# EAGLE design OSSC_HDMI_Audio_v1.5_A3b (EAGLE 6.6.0)
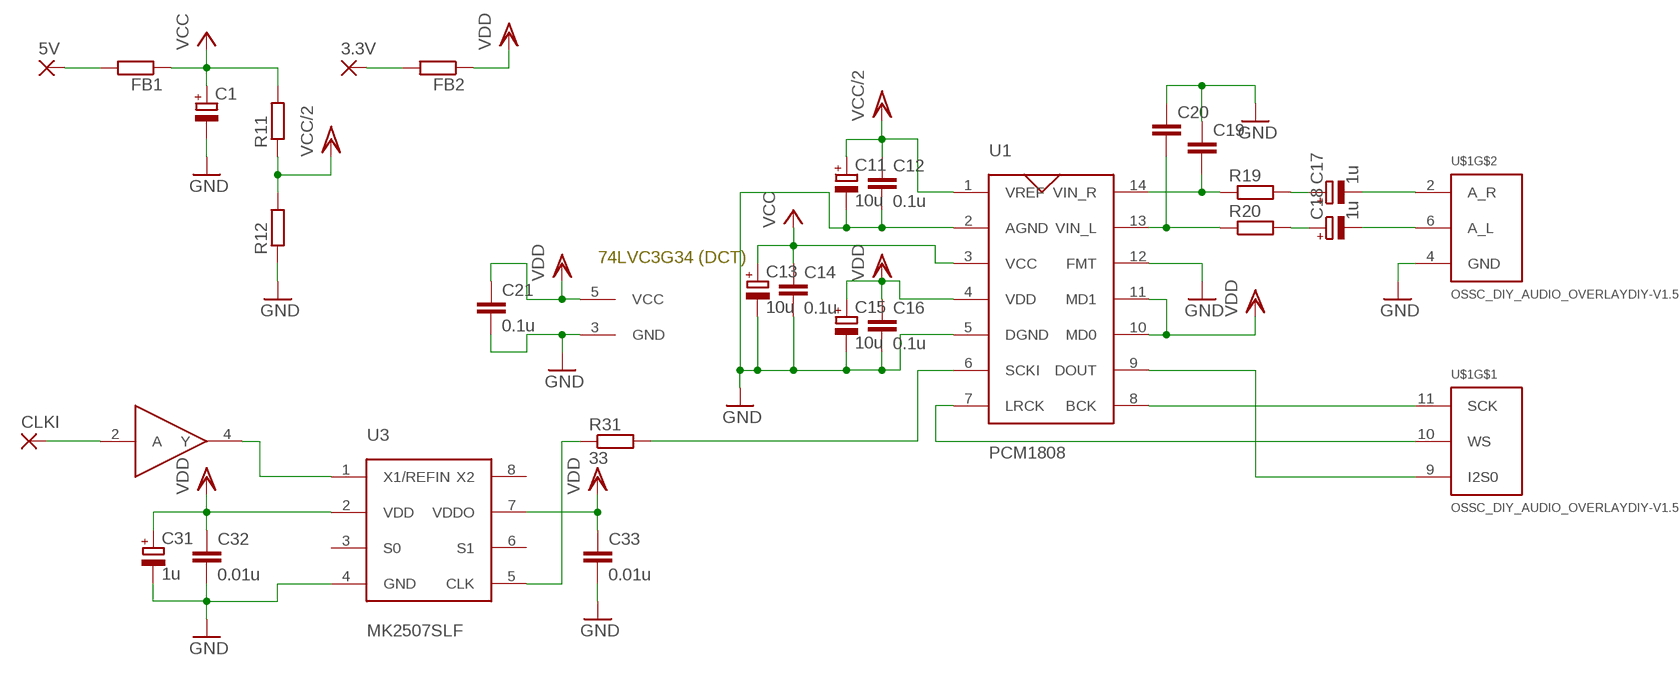
[diagram p0: schematic, sheet 1]

## Parts
3.3V  SMD2  [SMD1,27-2,54]
5V  SMD2  [SMD1,27-2,54]
C1  CPOL-EUSMCC  [SMC_C]
C11  10u  CPOL-EUSMCA  [SMC_A]
C12  0.1u  C-EUC0603  [C0603]
C13  10u  CPOL-EUSMCA  [SMC_A]
C14  0.1u  C-EUC0603  [C0603]
C15  10u  CPOL-EUSMCA  [SMC_A]
C16  0.1u  C-EUC0603  [C0603]
C17  1u  CPOL-EUSMCA  [SMC_A]
C18  1u  CPOL-EUSMCA  [SMC_A]
C19  C-EUC0603  [C0603]
C20  C-EUC0603  [C0603]
C21  0.1u  C-EUC0603  [C0603]
C31  1u  CPOL-EUSMCA  [SMC_A]
C32  0.01u  C-EUC0603  [C0603]
C33  0.01u  C-EUC0603  [C0603]
CLKI  SMD2  [SMD1,27-2,54]
FB1  R-EU_R0603  [R0603]
FB2  R-EU_R0603  [R0603]
R11  R-EU_R0603  [R0603]
R12  R-EU_R0603  [R0603]
R19  R-EU_R0603  [R0603]
R20  R-EU_R0603  [R0603]
R31  33  R-EU_R0603  [R0603]
U1  PCM1808  [PCM1808]
U2  74LVC1G34  [74LVC1G34DCK]
U3  MK2507SLF  [SOIC8]
U$1  OSSC_DIY_AUDIO_OVERLAYDIY-V1.5  [OSSC_OVERLAY_V1.5]

## Nets
GND: C1.- C11.- C12.2 C13.- C14.2 C15.- C16.2 C19.1 C20.1 C21.2 C31.- C32.2 C33.2 R12.1 U1.2(AGND) U1.5(DGND) U1.12(FMT) U2.3(GND) U3.4(GND) U$1.4(GND)
N$1: C18.- U$1.6(A_L)
N$2: C17.- U$1.2(A_R)
N$3: C17.+ R19.2
N$4: C19.2 R19.1 U1.14(VIN_R)
N$5: C20.2 R20.1 U1.13(VIN_L)
N$6: C18.+ R20.2
N$7: R31.1 U3.5(CLK)
N$8: U2.4(Y) U3.1(X1/REFIN)
N$9: CLKI.1(P) U2.2(A)
N$10: 5V.1(P) FB1.2
N$11: 3.3V.1(P) FB2.2
N$13: U1.7(LRCK) U$1.10(WS)
N$14: U1.8(BCK) U$1.11(SCK)
N$15: U1.9(DOUT) U$1.9(I2S0)
N$17: R31.2 U1.6(SCKI)
VCC: C1.+ C13.+ C14.1 FB1.1 R11.2 U1.3(VCC)
VCC/2: C11.+ C12.1 R11.1 R12.2 U1.1(VREF)
VDD: C15.+ C16.1 C21.1 C31.+ C32.1 C33.1 FB2.1 U1.4(VDD) U1.10(MD0) U1.11(MD1) U2.5(VCC) U3.2(VDD) U3.7(VDDO)
Unconnected: U3.3(S0) U3.6(S1) U3.8(X2)

## Notes on the sheet
- 74LVC3G34 (DCT)

## Library data of the parts
3.3V 5V CLKI = wirepad:SMD2: SMD PAD
C1 C11 C13 C15 C17 C18 C31 = rcl:CPOL-EU: POLARIZED CAPACITOR, European symbol
C12 C14 C16 C19-C21 C32 C33 = rcl:C-EU: CAPACITOR, European symbol
FB1 FB2 R11 R12 R19 R20 R31 = rcl:R-EU_: RESISTOR, European symbol
U1 = OSSC_HDMI_Audio:PCM1808
U2 = OSSC_HDMI_Audio:74LVC1G34
U3 = OSSC_HDMI_Audio:MK2507SLF
U$1 = OSSC_HDMI_Audio:OSSC_DIY_AUDIO_OVERLAY

## Board
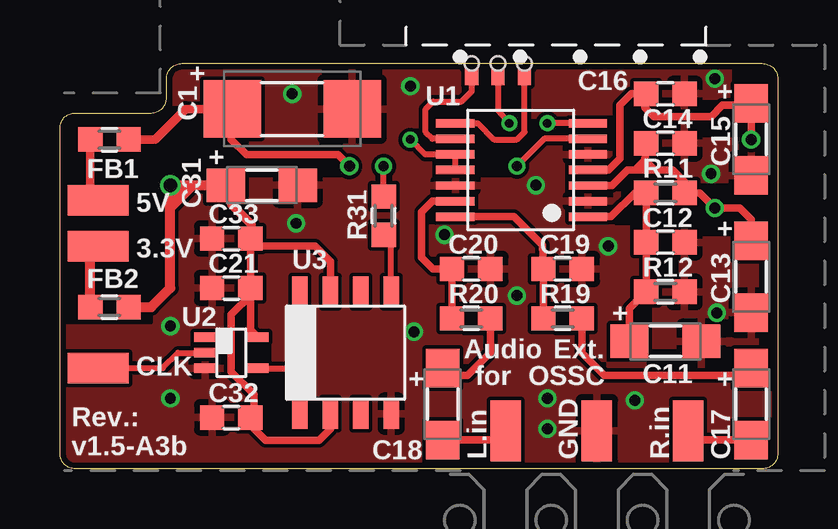
[diagram p1: board, top side]
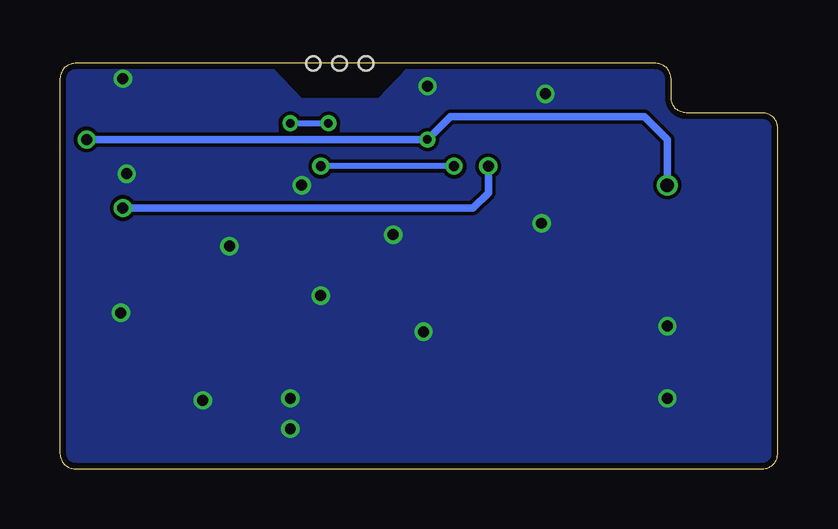
[diagram p2: board, bottom side, seen from below]

Size 29.92 x 16.91 mm. Coordinates in mm from the lower left corner, seen from the top.
Outline: 5.08,16.91 29.29,16.91 arc-90 29.92,16.27 29.92,0.63 arc-90 29.29,0 0.64,0 arc-90 0,0.63 0,14.21 arc-90 0.64,14.84 3.81,14.84 arc90 4.45,15.48 4.45,16.27 arc-90 5.08,16.91
Copper layers (1*16): Top 0.035mm / dielectric 1.5mm / Bottom 0.035mm
Design rules "SeeedStudio_2layer_DRU_no_angle_20140221": minimum track width 6mil, minimum drill 12mil, track to track 6mil, track to pad 6mil, pad to pad 6mil, via to via 6mil, smd to smd 0mil, copper to edge 10mil, drill to drill 10mil, minimum pad ring 10mil, minimum via ring 6mil, stop-mask expansion 2mil, vias tented up to drill 100mil, thermal gap 10mil
tRestrict: area 16.8,5.6 to 17.5,6.9; area 20.6,5.6 to 21.3,6.9; area 23.2,10.2 to 24.3,10.9; area 24.8,7.9 to 26.5,10.9; area 1.7,13.1 to 2.4,14.2; area 10.3,1.7 to 11,2.9; area 6.7,8.2 to 7.8,9; area 6.7,10.2 to 7.1,11; area 29.2,5.1 to 29.8,17.2; area 26.5,10.6 to 29.8,11.8; area 26.5,9.8 to 28.2,10.6; area 17.1,12.2 to 19.1,13.7; 7 more areas

### Footprints (pad centres in the part's own frame; a part is rotated, then mirrored left to right if it is on the bottom)
SMD1,27-2,54 = smd 1.27 x 2.54: 1 0,0
SMC_C = smd 2.4 x 2.4: + -2.5,0; - 2.5,0
SMC_A = smd 1.6 x 1.4: + -1.5,0; - 1.5,0
C0603 = smd 1.016 x 1.016: 1 -0.799,0; 2 0.799,0
R0603 = smd 1.016 x 1.016: 1 -0.799,0; 2 0.799,0
PCM1808 = smd 1.6 x 0.35: 1 -2.8,1.95; 2 -2.8,1.3; 3 -2.8,0.65; 4 -2.8,0; 5 -2.8,-0.65; 6 -2.8,-1.3; 7 -2.8,-1.95; 8 2.725,-1.95; 9 2.725,-1.3; 10 2.725,-0.65; 11 2.725,0; 12 2.725,0.65; 13 2.725,1.3; 14 2.725,1.95
74LVC1G34DCK = smd 0.9 x 0.4: 1 -1.1,0.65; 2 -1.1,0; 3 -1.1,-0.65; 4 1.1,-0.65; 5 1.1,0.65
SOIC8 = smd 1.27 x 0.635: 1 -2.54,1.905; 2 -2.54,0.635; 3 -2.54,-0.635; 4 -2.54,-1.905; 5 2.54,-1.905; 6 2.54,-0.635; 7 2.54,0.635; 8 2.54,1.905
OSSC_OVERLAY_V1.5 = smd 1.27 x 2.54: 2 3.81,8.811; 4 0,8.811; 6 -3.81,8.811 | smd 0.55 x 1.05: 9 -5.221,23.75; 10 -4.121,23.75; 11 -3.021,23.75 | hole 0.6: -3.021,24.13; -4.121,24.13; -5.221,24.13

### Placement (x,y rotation side)
3.3V  1.59,9.29 270 top
5V  1.59,11.19 270 top
C1  9.68,15 0 top
C11  25.24,5.32 0 top
C12  25.24,9.45 0 top
C13  28.81,8.02 270 top
C14  25.24,13.57 0 top
C15  28.81,13.73 270 top
C16  25.24,15.64 0 top
C17  28.81,2.7 270 top
C18  15.95,2.7 270 top
C19  20.95,8.33 180 top
C20  17.14,8.33 180 top
C21  7.14,7.54 180 top
C31  8.41,11.83 0 top
C32  7.14,9.6 180 top
C33  7.14,2.14 180 top
CLKI  1.59,4.21 270 top
FB1  2.06,13.73 180 top
FB2  2.06,6.75 180 top
R11  25.24,11.51 0 top
R12  25.24,7.38 180 top
R19  20.95,6.27 0 top
R20  17.14,6.27 0 top
R31  13.49,10.56 90 top
U1  19.21,12.46 180 top
U2  7.14,4.84 0 top
U3  11.91,4.84 90 top
U$1  22.38,-7.22 0 top

### Tracks (layer width: path | path; a pad name or v marks a point on that pad's centre or on a via)
GND  (via drill 0.46)
  other vias: 20.32,2.94 20.32,1.67 16.03,9.76 22.86,9.29 4.6,5.95 4.6,2.94 9.84,10.24 19.84,11.83 14.76,5.71 14.61,15.95 19.05,7.22 27.15,12.3 23.97,2.86 27.38,6.51 27.3,16.27 9.68,15.64
  pour Top (rank 6): -2.54,-2.14 31.75,-2.14 31.75,17.07 -2.54,17.07
  pour Bottom (rank 6): -1.27,-0.71 30.48,-0.71 30.48,17.07 21.59,17.07 19.92,15.32 16.59,15.32 14.92,17.07 -1.27,17.07
N$1
  Top 0.305: C18.- 18.11,1.2 U$1.6
N$2
  Top 0.305: C17.- 26.66,1.2 U$1.2
N$3
  Top 0.305: R19.2 21.75,4.84 22.7,3.89 28.5,3.89 C17.+
N$4
  Top 0.305: R19.1 C19.2 20.11,9.34 18.94,10.51 U1.14
N$5
  Top 0.305: U1.13 15.53,11.16 15.08,10.72 15.08,8.81 15.56,8.33 C20.2 R20.1
N$6
  Top 0.305: 15.96,4.21 C18.+ 16.26,3.89 16.99,3.89 17.94,4.85 R20.2
N$7
  Top 0.254: U3.5 13.81,9.44 R31.1
N$8
  Top 0.254: U2.4 9.54,4.19 10,3.73 U3.1
N$9
  Top 0.254: CLKI.1 4.29,4.21 4.92,4.84 U2.2
N$10
  Top 0.356: FB1.2 1.27,11.19 5V.1
N$11
  Top 0.406: FB2.2 1.27,9.13 1.59,9.13 3.3V.1
N$13  (via drill 0.36)
  Top 0.254: U1.7 v20.32,14.41 | U$1.10 18.26,14.96 v18.73,14.41
  Bottom 0.254: v20.32,14.41 v18.73,14.41
N$14
  Top 0.254: U1.8 17.42,14.41 18.1,13.73 19.05,13.73 19.37,14.05 19.37,16.44 U$1.11
N$15
  Top 0.254: U1.9 15.53,13.76 15.24,14.05 15.24,15 15.56,15.32 16.75,15.32 17.16,15.73 U$1.9
N$17  (via drill 0.41)
  Top 0.254: R31.2 v13.49,12.62 | U1.6 20.19,13.76 v19.05,12.62
  Bottom 0.254: v13.49,12.62 v19.05,12.62
VCC  (via drill 0.46)
  Top 0.305: 24.39,12.88 23.97,12.46 | 24.39,12.88 24.81,12.46 | 24.61,12.46 23.97,12.46 | 24.81,12.46 24.61,12.46 | 24.61,12.46 24.45,12.62 | 24.81,12.46 25.56,12.46 26.04,11.99 26.04,11.61 R11.2 | 24.39,12.88 C14.1 | v12.06,12.62 11.59,13.1 7.78,13.1 7.14,13.73 7.14,14.96 C1.+ | R11.2 26.09,11.45 | R11.2 26.67,11.51 v27.3,10.87 28.34,10.87 28.81,10.4 C13.+ | U1.3 23,11.81 23.65,12.46 23.97,12.46
  Top 0.356: FB1.1 3.97,13.73 5.24,15 C1.+
  Bottom 0.305: v12.06,12.62 12.06,11.51 12.7,10.87 v27.3,10.87
VCC/2
  Top 0.305: U1.1 22.97,10.51 23.97,11.51 R11.1 C12.1 R12.2 23.74,6.68 C11.+
VDD  (via drill 0.36, 0.46, 0.56)
  Top 0.254: 28.5,15.16 C15.+ | U1.11 U1.10 15.22,13.11 v14.61,13.73
  Top 0.305: 8.1,2.3 8.1,1.67 8.57,1.19 10.79,1.19 11.27,1.67 U3.2 | 28.5,15.16 27.62,15.16 27.15,14.68 24.77,14.68 24.39,15.06 C16.1 23.81,15.64 23.34,15.16 23.34,12.94 22.86,12.46 U1.4 | U3.7 11.27,8.65 10.64,9.29 8.31,9.29 C32.1 C21.1 | C33.1 8.1,2.3 | 8.1,2.3 8.1,3.1 7.14,4.05 7.14,6.43 7.99,7.28 C21.1 | C15.+ v28.81,13.73 | U2.5 7.94,5.79 C21.1
  Top 0.356: C32.1 7.99,10.18 7.14,11.03 7.14,11.6 C31.+
  Top 0.406: FB2.1 3.81,6.75 4.6,7.54 4.6,10.87 | 4.6,11.35 v4.6,11.83 5.08,11.83 | 5.08,11.83 5.56,11.83 | 5.56,11.83 4.6,10.87 | 4.6,10.87 4.6,11.35 | 4.6,11.35 5.08,11.83 | 5.56,11.83 C31.+
  Bottom 0.305: v4.6,11.83 4.6,13.73 5.56,14.68 13.65,14.68 v14.61,13.73 v28.81,13.73

### Text on the board
tPlace: + | + | + | + | + | Audio | Ext. | + | for | OSSC | +
tNames: C16 | C1 | U1 | C14 | FB1 | C15 | R11 | 5V | C31 | C33 | R31 | C12 | 3.3V | U3 | C20 | C19 | FB2 | C21 | R12 | R20 | R19 | C13 | U2 | CLK | C11 | C32 | Rev.: / v1.5-A3b | C18 | L.in | GND | R.in | C17